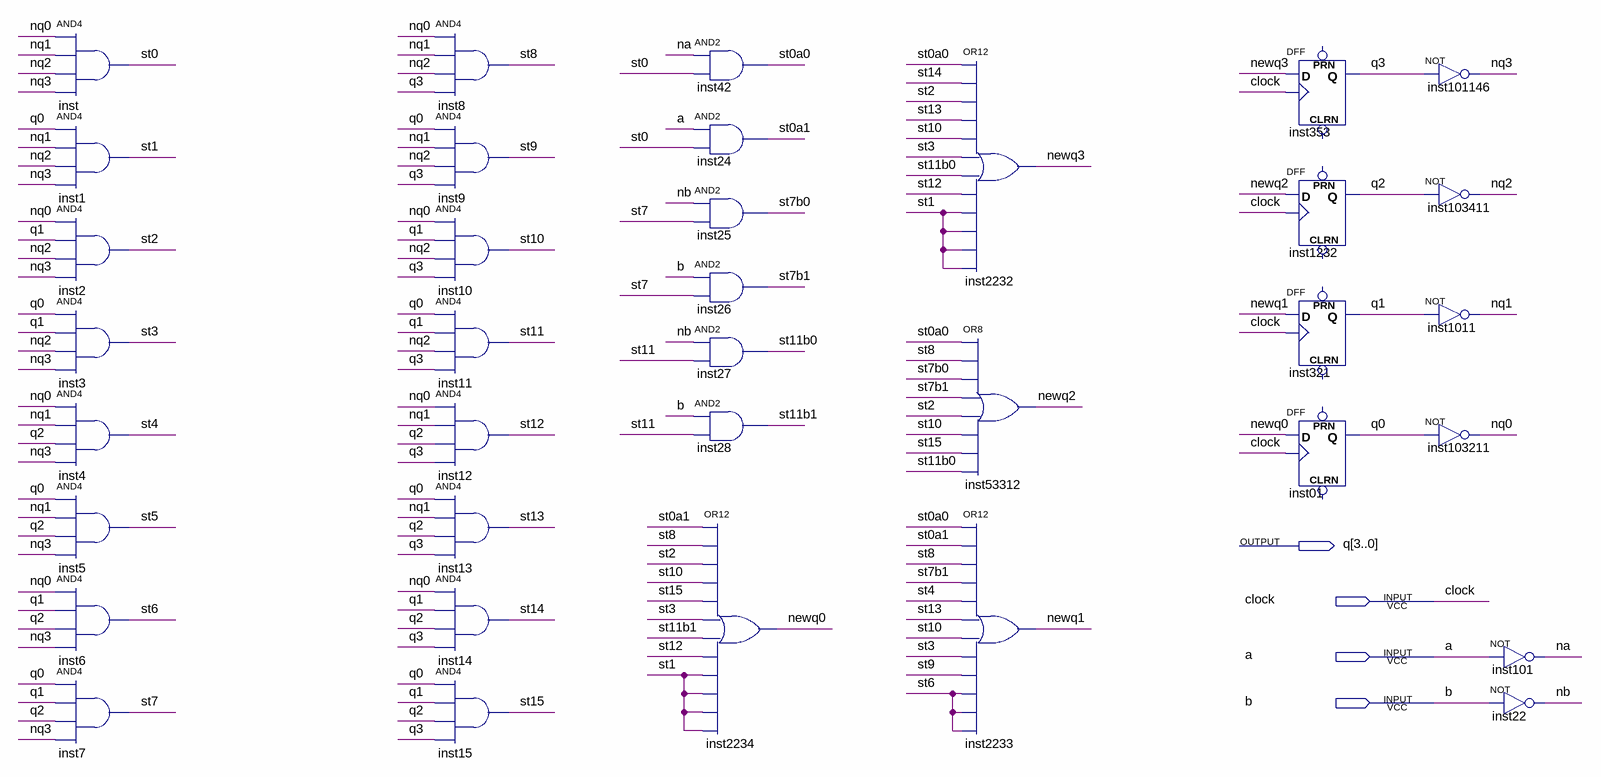
[diagram p0: schematic sheet]
// Quartus schematic pract6.bdf as structural Verilog: 36 symbols, 4 pins
module pract6 (
  input  clock,
  input  a,
  input  b,
  output [3:0] q
);

  wire na, nb, newq0, newq1, newq2, newq3, nq0, nq1, nq2, nq3, st0, st0a0, st0a1, st1, st2, st3, st4, st5,
       st6, st7, st7b0, st7b1, st8, st9, st10, st11, st11b0, st11b1, st12, st13, st14, st15;

  and inst (st0, nq0, nq1, nq2, nq3);
  and inst1 (st1, q[0], nq1, nq2, nq3);
  and inst2 (st2, nq0, q[1], nq2, nq3);
  and inst3 (st3, q[0], q[1], nq2, nq3);
  and inst4 (st4, nq0, nq1, q[2], nq3);
  and inst5 (st5, q[0], nq1, q[2], nq3);
  and inst6 (st6, nq0, q[1], q[2], nq3);
  and inst7 (st7, q[0], q[1], q[2], nq3);
  and inst8 (st8, nq0, nq1, nq2, q[3]);
  and inst9 (st9, q[0], nq1, nq2, q[3]);
  and inst10 (st10, nq0, q[1], nq2, q[3]);
  and inst11 (st11, q[0], q[1], nq2, q[3]);
  and inst12 (st12, nq0, nq1, q[2], q[3]);
  and inst13 (st13, q[0], nq1, q[2], q[3]);
  and inst14 (st14, nq0, q[1], q[2], q[3]);
  and inst15 (st15, q[0], q[1], q[2], q[3]);
  and inst42 (st0a0, na, st0);
  and inst24 (st0a1, a, st0);
  and inst25 (st7b0, nb, st7);
  and inst26 (st7b1, b, st7);
  and inst27 (st11b0, nb, st11);
  and inst28 (st11b1, b, st11);
  or inst2234 (newq0, st0a1, st8, st2, st10, st15, st3, st11b1, st12, st1, st1, st1, st1);
  or inst2232 (newq3, st0a0, st14, st2, st13, st10, st3, st11b0, st12, st1, st1, st1, st1);
  or inst53312 (newq2, st0a0, st8, st7b0, st7b1, st2, st10, st15, st11b0);
  or inst2233 (newq1, st0a0, st0a1, st8, st7b1, st4, st13, st10, st3, st9, st6, st6, st6);
  DFF inst353 (.CLK(clock), .D(newq3), .Q(q[3]));  // open: CLRN, PRN
  DFF inst1232 (.CLK(clock), .D(newq2), .Q(q[2]));  // open: CLRN, PRN
  DFF inst321 (.CLK(clock), .D(newq1), .Q(q[1]));  // open: CLRN, PRN
  DFF inst01 (.CLK(clock), .D(newq0), .Q(q[0]));  // open: CLRN, PRN
  not inst101146 (nq3, q[3]);
  not inst103411 (nq2, q[2]);
  not inst1011 (nq1, q[1]);
  not inst103211 (nq0, q[0]);
  not inst101 (na, a);
  not inst22 (nb, b);
endmodule
